# EAGLE design THAT_1646_Breakout (EAGLE 7.7.0)
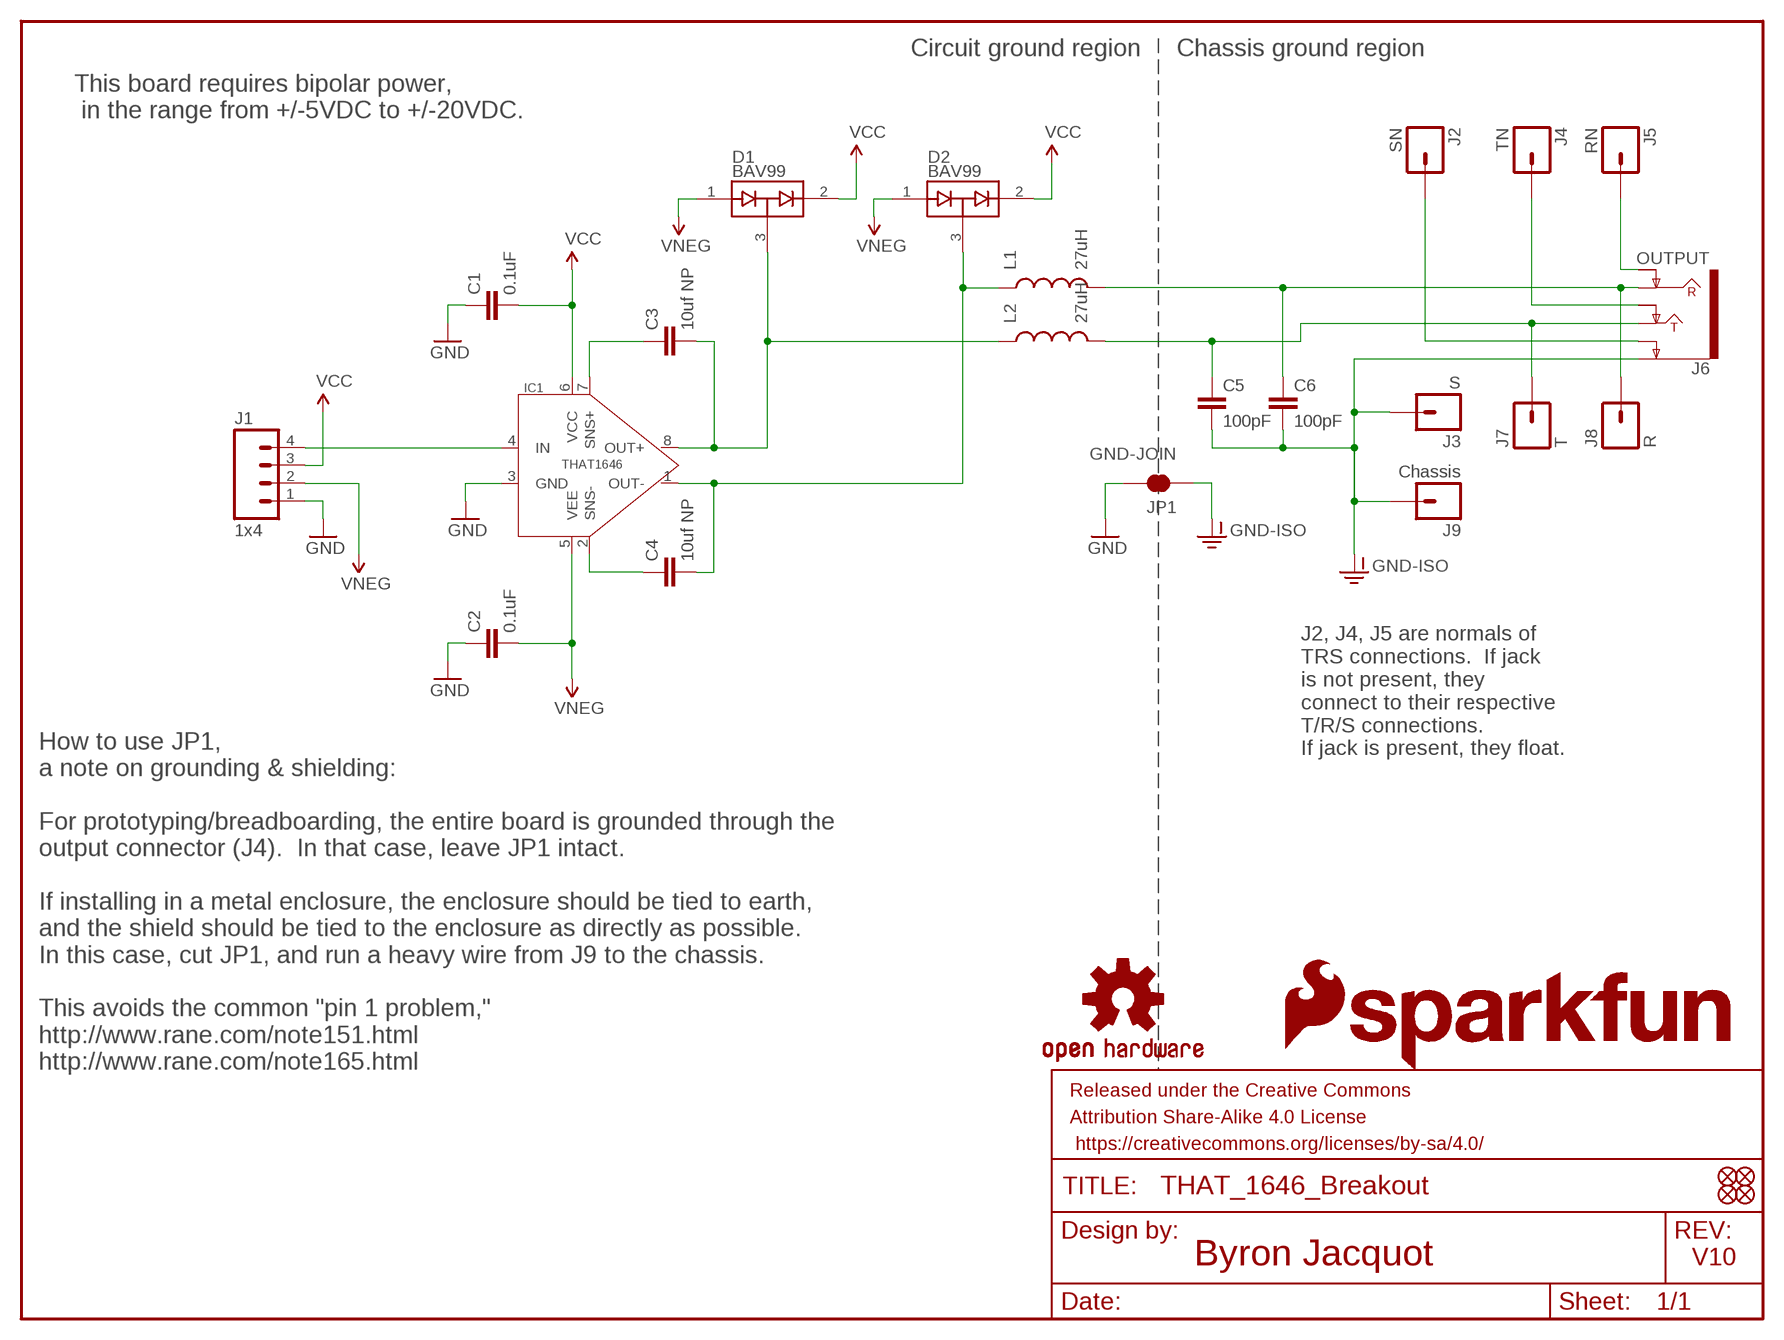
[diagram p0: schematic, sheet 1]

## Parts
C1  0.1uF  0.1UF-25V-5%(0603)  [0603-CAP]
C2  0.1uF  0.1UF-25V-5%(0603)  [0603-CAP]
C3  10uf NP  PANA-EEE-1EA100NP  [PANASONIC_D]
C4  10uf NP  PANA-EEE-1EA100NP  [PANASONIC_D]
C5  100pF  100PF-50V-5%(0603)  [0603-CAP]
C6  100pF  100PF-50V-5%(0603)  [0603-CAP]
D1  BAV99  [SOT23-3]
D2  BAV99  [SOT23-3]
FD1  FIDUCIALUFIDUCIAL  [MICRO-FIDUCIAL]
FD2  FIDUCIALUFIDUCIAL  [MICRO-FIDUCIAL]
FD3  FIDUCIALUFIDUCIAL  [MICRO-FIDUCIAL]
FD4  FIDUCIALUFIDUCIAL  [MICRO-FIDUCIAL]
FRAME1  FRAME-LETTER  [CREATIVE_COMMONS]
IC1  THAT1646  [SO08]
J1  1x4  M04NO_SILK_ALL_ROUND  [1X04_NO_SILK_ALL_ROUND]
J2  SN  M01PTH_NO_SILK_YES_STOP  [1X01_NO_SILK]
J3  S  M01PTH_NO_SILK_YES_STOP  [1X01_NO_SILK]
J4  TN  M01PTH_NO_SILK_YES_STOP  [1X01_NO_SILK]
J5  RN  M01PTH_NO_SILK_YES_STOP  [1X01_NO_SILK]
J6  OUTPUT  AUDIO_JACK_TRS_0.25"_PTH_RA  [AUDIO_JACK_0.25"_TRS_PTH_RA]
J7  T  M01PTH_NO_SILK_YES_STOP  [1X01_NO_SILK]
J8  R  M01PTH_NO_SILK_YES_STOP  [1X01_NO_SILK]
J9  Chassis  M01PTH_NO_SILK_YES_STOP  [1X01_NO_SILK]
JP1  GND-JOIN  JUMPER-PAD-2-NC_BY_TRACE  [PAD-JUMPER-2-NC_BY_TRACE_YES_SILK]
L1  27uH  INDUCTOR0603  [0603]
L2  27uH  INDUCTOR0603  [0603]
LOGO1  OSHW-LOGOS  [OSHW-LOGO-S]
LOGO2  OSHW-LOGOS  [OSHW-LOGO-S]
LOGO4  SFE_LOGO_FLAME.2_INCH  [SFE_LOGO_FLAME_.2]
LOGO5  SFE_LOGO_NAME.1_INCH  [SFE_LOGO_NAME_.1]

## Nets
GND: C1.1 C2.1 IC1.3(GND) J1.1 JP1.2
GND-ISO: C5.2 C6.2 J3.1 J6.SLEEVE(EARTH) J9.1 JP1.1
N$1: J5.1 J6.RING-NORM
N$2: J4.1 J6.TIP-NORM
N$3: J2.1 J6.SLEEVE-NORM(EARTH-NORM)
N$8: C5.1 J6.TIP J7.1 L2.2
N$9: C6.1 J6.RING J8.1 L1.2
N$10: C3.- D1.3(COM) IC1.8(OUT+) L2.1
N$11: C4.- D2.3(COM) IC1.1(OUT-) L1.1
N$13: C4.+ IC1.2(SNS-)
N$14: C3.+ IC1.7(SNS+)
N$16: IC1.4(IN) J1.4
VCC: C1.2 D1.2(C2) D2.2(C2) IC1.6(VCC) J1.3
VNEG: C2.2 D1.1(A1) D2.1(A1) IC1.5(VEE) J1.2

## Notes on the sheet
- Circuit ground region | Chassis ground region
- This board requires bipolar power,
   in the range from +/-5VDC to +/-20VDC.
- J2, J4, J5 are normals of 
  TRS connections.  If jack 
  is not present, they 
  connect to their respective 
  T/R/S connections.  
  If jack is present, they float.
- How to use JP1,
  a note on grounding & shielding:
  
  For prototyping/breadboarding, the entire board is grounded through the 
  output connector (J4).  In that case, leave JP1 intact.
  
  If installing in a metal enclosure, the enclosure should be tied to earth, 
  and the shield should be tied to the enclosure as directly as possible.  
  In this case, cut JP1, and run a heavy wire from J9 to the chassis.
  
  This avoids the common "pin 1 problem," 
  http://www.rane.com/note151.html
  http://www.rane.com/note165.html
- Byron Jacquot | V10

## Library data of the parts
C1 C2 = SparkFun-Capacitors:0.1UF-25V-5%(0603): CAP-08604; PROD_ID: CAP-08604
C3 C4 = that-ics:PANA-EEE-1EA100NP: Panasonic 10uf 25V nonpolar. Panasonic EEE-1EA100NP Digikey PCE4294TR-ND; DK_PN: PCE4294TR-ND; MFR: Panasonic; MFR_PN: 1ea100np; PROD_ID: CAP-13474
C5 C6 = SparkFun-Capacitors:100PF-50V-5%(0603): CAP-07883; PROD_ID: CAP-07883
D1 D2 = SparkFun-DiscreteSemi:BAV99: Two small signal silicon diodes connected anode to cathode. Connections to all three nodes available. DIO-10647; PROD_ID: DIO-10647
FD1-FD4 = SparkFun-Aesthetics:FIDUCIAL: Fiducial Alignment Points Various fiducial points for machine vision alignment.
FRAME1 = SparkFun-Aesthetics:FRAME-LETTER: Schematic Frame Standard 8.5x11 US Letter frame
IC1 = that-ics:THAT1646: THAT Corporation 1646 OutSmarts Balanced line driver; PROD_ID: IC-13473
J1 = SparkFun-Connectors:M04: Header 4 Standard 4-pin 0.1" header. Use with straight break away headers (SKU : PRT-00116), right angle break away headers (PRT-00553), swiss pins (PRT-00743), machine pins (PRT-00117), and female headers (PRT-00115). Molex polarized connector foot print use with SKU : PRT-08231 with associated crimp pins and housings. 1MM SMD Version SKU: PRT-10208; PROD_ID: CONN-09696
J2-J5 J7-J9 = SparkFun-Connectors:M01: Header 1 Standard 1-pin 0.1" header. Use with straight break away headers (SKU : PRT-00116), right angle break away headers (PRT-00553), swiss pins (PRT-00743), machine pins (PRT-00117), and female headers (PRT-00115). SMTSO-256-ET is a "flush mount" nut for a 4-40 screw. The older package used to be too tight, and did not allow it to sit properly thru the drill hit. The latest (0.165DIA) fits nice and snug.
J6 = SparkFun-Connectors:AUDIO_JACK_TRS_0.25"_PTH_RA: Audio Jack, 1/4" TRS jack, horizontal, PTH, aka "Phono jack" Find the connector here: Audio Jack - 1/4" Stereo (right angle) <https://www.sparkfun.com/products/11144> (COM-11144) Datasheet <http://cdn.sparkfun.com/datasheets/Components/General/JP-611%20DD.jpg> Note, although the datasheet and physical part are slightly different, this footprint was proven to mate well on the Proto Pedal. This device is used on these SparkFun Products: SparkFun TRS Jack Breakout - 1/4" Stereo <https://www.sparkfun.com/products/13005> (BOB-13005 ) SparkFun Proto Pedal - sorry bad link - product comming soon! <https://www.sparkfun.com/products/13124> (PRT-13124); PROD_ID: CONN-12339; SF_ID: COM-11144
JP1 = SparkFun-Passives:JUMPER-PAD-2-NC_BY_TRACE
L1 L2 = SparkFun-Passives:INDUCTOR: Inductors Basic Inductor/Choke - 0603 and 1206. Footprints are not proven and vary greatly between part numbers. INDUCTOR POWER 3.3UH 4.0A SMD 0.197" L x 0.197" W x 0.177" H (5.00mm x 5.00mm x 4.50mm); PROD_ID: NDUC-12579
LOGO1 LOGO2 = SparkFun-Aesthetics:OSHW-LOGO: Open Source Hardware Logo This logo indicates the piece of hardware it is found on incorporates a OSHW license and/or adheres to the definition of open source hardware found here: http://freedomdefined.org/OSHW
LOGO4 = SparkFun-Aesthetics:SFE_LOGO_FLAME: SFE Logo, flame only This is the SparkFun flame logo. The logo on the schematic will always be the same size; the package variant is the height of the flame. Default layer for the logo on the board is tSilk.
LOGO5 = SparkFun-Aesthetics:SFE_LOGO_NAME: SFE Logo, name only This is the SparkFun name logo. The logo on the schematic will always be the same size; the package variant is the height of the flame part of the logo (or the height the flame would be, if it were drawn). Default layer for the logo on the board is tSilk.

## Board
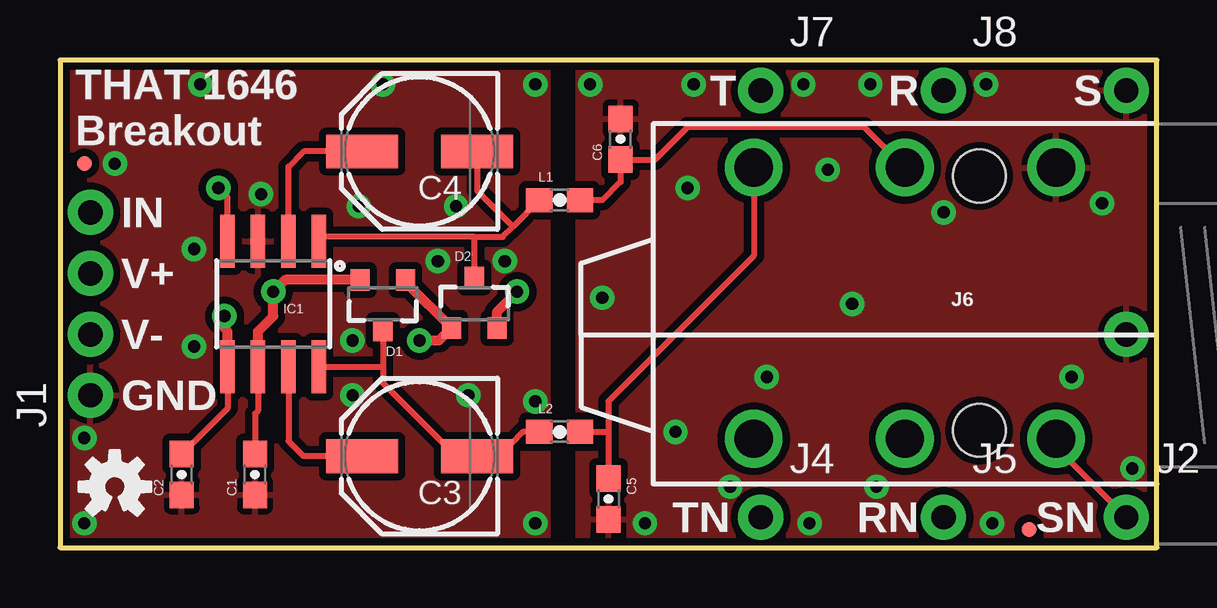
[diagram p1: board, top side]
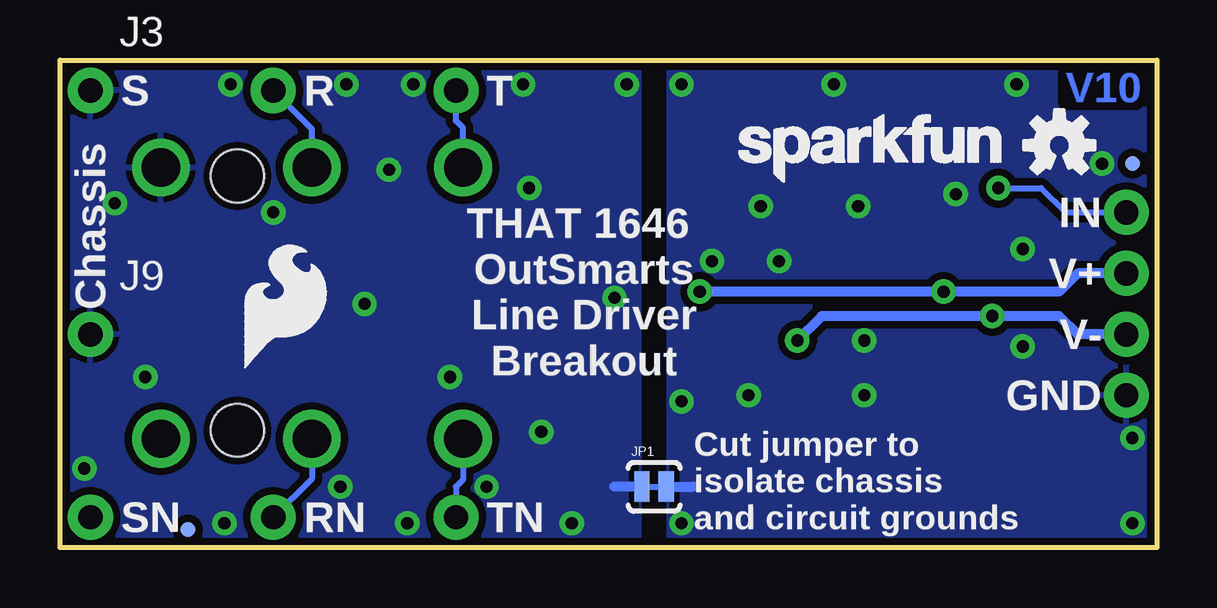
[diagram p2: board, bottom side, seen from below]

Size 45.72 x 20.32 mm. Coordinates in mm from the lower left corner, seen from the top.
Outline: 0,0 45.72,0 45.72,20.32 0,20.32 0,0
Copper layers (1*16): Top 0.035mm / dielectric 1.5mm / Bottom 0.035mm
Design rules "SparkFun-2-layer-STANDARD": minimum track width 10mil, minimum drill 20mil, track to track 10mil, track to pad 8mil, pad to pad 8mil, via to via 10mil, smd to smd 8mil, copper to edge 8mil, drill to drill 8mil, minimum pad ring 10mil, minimum via ring 10mil, stop-mask expansion 4mil, vias tented up to drill 25mil, thermal gap 10mil

### Footprints (pad centres in the part's own frame; a part is rotated, then mirrored left to right if it is on the bottom)
0603-CAP = smd 1.1 x 1: 1 -0.85,0; 2 0.85,0
PANASONIC_D = smd 3 x 1.4: + 2.4,0; - -2.4,0
SOT23-3 = smd 0.8 x 0.9: 1 -0.95,-1; 2 0.95,-1; 3 0,1.1
MICRO-FIDUCIAL = smd 0.635 x 0.635: 1 0,0
SO08 = smd 0.61 x 2.21: 1 -1.905,-2.616; 2 -0.635,-2.616; 3 0.635,-2.616; 4 1.905,-2.616; 5 1.905,2.616; 6 0.635,2.616; 7 -0.635,2.616; 8 -1.905,2.616
1X04_NO_SILK_ALL_ROUND = drill 1.016 pad 1.88: 1 0,0; 2 2.54,0; 3 5.08,0; 4 7.62,0
1X01_NO_SILK = drill 1.016 pad 1.88: 1 0,0
AUDIO_JACK_0.25"_TRS_PTH_RA = drill 1.6: RING 10.5,-6.95; RING-NORM 10.5,4.35; SLEEVE 4.2,-6.95; SLEEVE-NORM 4.2,4.35; TIP 16.8,-6.95; TIP-NORM 16.8,4.35 | hole 2.2: 7.4,4; 7.4,-6.6
PAD-JUMPER-2-NC_BY_TRACE_YES_SILK = smd 0.635 x 1.27: 1 -0.508,0; 2 0.508,0
0603 = smd 1.1 x 1: 1 -0.85,0; 2 0.85,0

### Placement (x,y rotation side)
C1  8.13,3.05 90 top
C2  5.08,3.05 90 top
C3  14.99,3.81 180 top
C4  14.99,16.51 180 top
C5  22.86,2.03 270 top
C6  23.37,17.02 90 top
D1  13.46,10.16 180 top
D2  17.27,10.16 0 top
FD1  1.02,16 0 bottom
FD2  40.39,0.76 0 bottom
FD3  1.02,16 0 top
FD4  40.39,0.76 0 top
FRAME1  16.51,-20.32 0 top  (outside the outline)
IC1  8.89,10.16 180 top
J1  1.27,6.35 90 top
J2  44.45,1.27 0 top
J3  44.45,19.05 0 bottom
J4  29.21,1.27 0 top
J5  36.83,1.27 0 top
J6  45.72,8.89 180 top
J7  29.21,19.05 0 top
J8  36.83,19.05 0 top
J9  44.45,8.89 0 bottom
JP1  20.95,2.54 0 bottom
L1  20.83,14.48 0 top
L2  20.83,4.83 0 top
LOGO1  2.29,2.54 0 top
LOGO2  4.06,16.76 0 bottom
LOGO4  38.35,7.24 0 bottom
LOGO5  17.91,14.73 0 bottom

### Tracks (layer width: path | path; a pad name or v marks a point on that pad's centre or on a via)
GND  (via drill 0.51)
  Bottom 0.406: JP1.2 19.3,2.54
  other vias: 1.02,1.02 5.59,8.38 5.59,12.45 1.02,4.57 2.29,16 5.84,19.3 19.81,19.3 18.54,11.94 15.75,11.94 12.19,8.64 12.19,6.35 17.02,6.35 19.81,6.1 19.81,1.02 8.38,14.73 12.45,14.22 16.51,14.22 13.46,19.3
  pour Top (isolate 0.305): 20.32,20.32 20.32,0 0,0 0,20.32
  pour Bottom (isolate 0.305): 0,20.32 0,0 20.32,0 20.32,20.32
GND-ISO  (via drill 0.51)
  Bottom 0.406: JP1.1 22.61,2.54
  other vias: 22.1,19.3 26.42,19.3 36.83,13.97 42.16,7.11 33.02,10.16 29.46,7.11 31.24,1.02 27.94,2.54 34.04,2.54 44.7,3.3 22.61,10.41 26.16,14.99 25.65,4.83 38.86,1.02 32,15.75 30.99,19.3 33.78,19.3 38.61,19.3 24.38,1.02 43.43,14.35
  pour Bottom (isolate 0.305): 21.59,0 21.59,20.32 45.72,20.32 45.72,0
  pour Top (isolate 0.305): 45.72,0 45.72,20.32 21.59,20.32 21.59,0
N$1
  Bottom 0.254: J6.RING-NORM 35.22,2.88 J5.1
N$2
  Bottom 0.254: J6.TIP-NORM 28.92,2.83 29.21,2.54 J4.1
N$3
  Top 0.254: J2.1 41.52,4.2 J6.SLEEVE-NORM
N$8
  Top 0.254: 22.86,4.83 22.86,6.1 28.92,12.16 J6.TIP | 22.86,4.83 C5.1 | L2.2 22.86,4.83
  Bottom 0.254: J6.TIP 28.92,17.49 29.21,17.78 J7.1
N$9
  Top 0.254: L1.2 22.61,14.48 23.37,15.24 C6.1 24.8,16.17 26.16,17.53 33.53,17.53 J6.RING
  Bottom 0.254: J6.RING 35.22,17.44 J8.1
N$10
  Top 0.254: IC1.8 13.46,7.54 | D1.3 13.46,7.54 | L2.1 19.3,4.83 18.8,4.32 17.89,4.32 C3.- 17.13,4.06 16.26,4.06 13.46,6.86 13.46,7.54
N$11
  Top 0.254: 17.27,12.95 10.97,12.95 IC1.1 | D2.3 17.27,12.95 | 18.88,13.38 18.45,12.95 17.27,12.95 | 18.88,13.38 L1.1 | C4.- 17.39,14.87 18.88,13.38
N$13
  Top 0.254: IC1.2 9.53,15.88 10.16,16.51 C4.+
N$14
  Top 0.254: IC1.7 9.53,4.45 10.16,3.81 C3.+
N$16  (via drill 0.51)
  Top 0.254: IC1.4 6.99,14.61 v6.6,14.99
  Bottom 0.254: v6.6,14.99 4.83,14.99 3.81,13.97 J1.4
VCC  (via drill 0.51)
  Top 0.254: IC1.6 8.26,5.71 8.13,5.59 C1.2
  Top 0.406: D2.2 18.22,9.84 v19.05,10.67 | IC1.6 8.26,9.02 8.89,9.65 v8.89,10.67 9.38,11.16 D1.2
  Bottom 0.406: J1.3 3.3,11.43 4.06,10.67 v8.89,10.67 v19.05,10.67
VNEG  (via drill 0.51)
  Top 0.254: D1.1 14.41,11.07 | IC1.5 6.99,5.8 C2.2
  Top 0.406: 14.41,11.07 D2.1 15.8,8.64 v14.99,8.64 | IC1.5 6.99,9.02 6.86,9.14 v6.86,9.65
  Bottom 0.406: J1.2 3.3,8.89 4.06,9.65 v6.86,9.65 13.97,9.65 v14.99,8.64

### Text on the board
Bottom: V10
tPlace: T | R | S | THAT 1646 / Breakout | IN | V+ | V- | GND | TN | RN | SN
bPlace: T | R | S | IN | V+ | THAT 1646 / OutSmarts / Line Driver / Breakout | Chassis | V- | GND | Cut jumper to / isolate chassis / and circuit grounds | TN | RN | SN
Measures: Drill 0.440" (11mm) hole to / accomodate TRS jack | All dimensions in inches
tDocu: Byron Jacquot